# EasyEDA Pro project 蓝牙歌词音箱.epro, board 转接板PCB
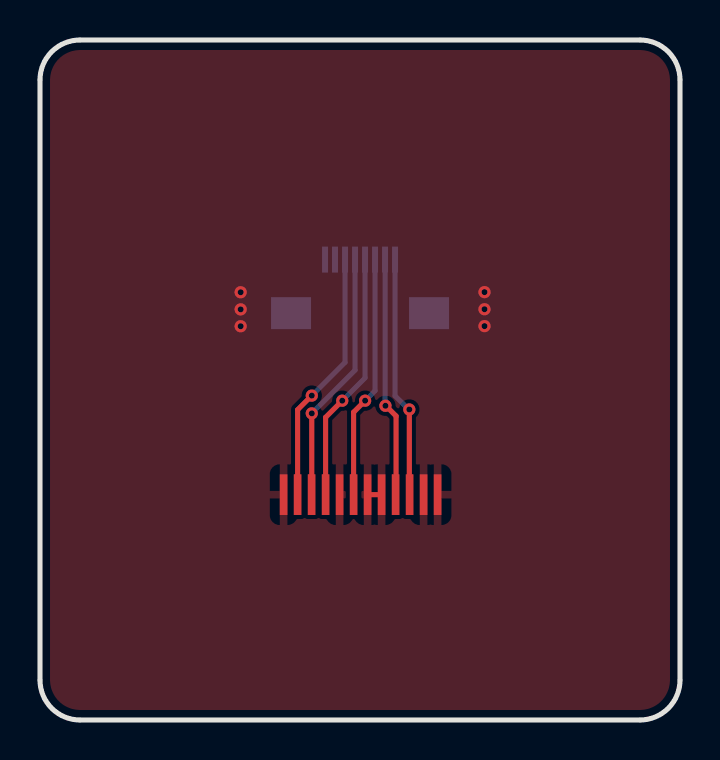
[diagram p2: board, top side]
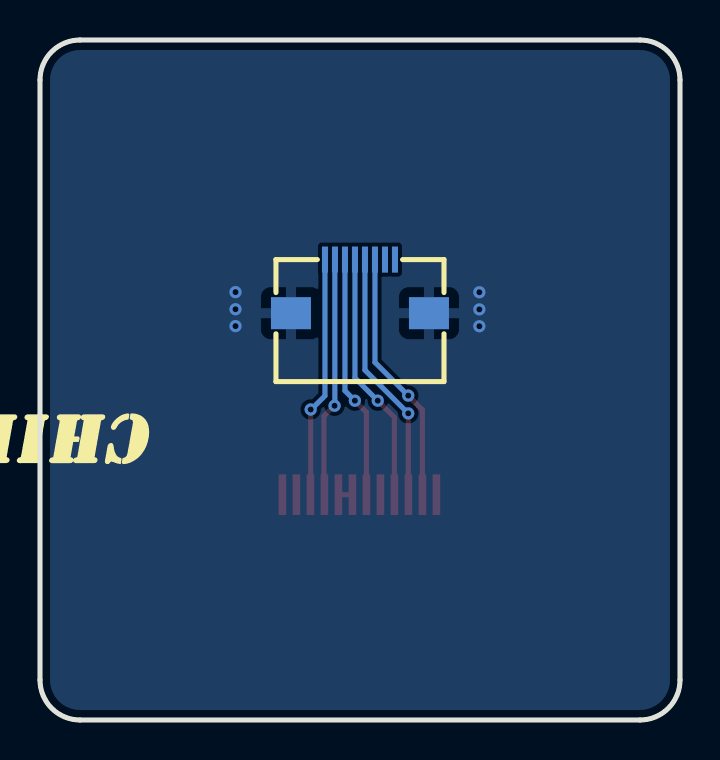
[diagram p3: board, bottom side, seen from below]

Outline 32 x 34 mm; copper layers: Top Layer, Bottom Layer. Coordinates in mm from the lower left corner of the outline.
Outline path: 0,32 0,2 arc(0.59,0.59) 2,0 30,0 arc(31.41,0.59) 32,2 32,32 arc(31.41,33.41) 30,34 2,34 arc(0.59,33.41) 0,32
Stack: Top Layer 0.035mm / Dielectric1 1.51mm FR4 er 4.5 / Bottom Layer 0.035mm

## Design rules (mm)
template: JLCPCB Capability(Two Layers Board)
spacing copperThickness1oz (default): track to track 0.102, other pairs 0.152 to 0.3
spacing copperThickness2oz: track to track 0.203, other pairs 0.152 to 0.3
track width copperThickness1oz (default): min 0.127, default 0.254, max 2.54
track width copperThickness2oz: min 0.203, default 0.254, max 2.54
differential pair differentialPair (default): width min 0.127, default 0.254, max 2.54; gap min 0.152, default 0.152
via viaSize (default): diameter min 0.5, default 0.61, max 10; hole min 0.3, default 0.305, max 6.3

## Placement (name value [footprint] x y rotation side)
FPC1  AFC01-S08FCA-00  [FPC-SMD_P0.50-8P_FGS-XJ-H2.0]  16 21.68 0 bottom
LCD1  ST7789-240x240  [LCD-240X240-12P-1.54]  16 11.52 0 top

## Footprints (pads in the part's own frame, mm; a bottom-side part is the same pattern mirrored in y, then rotated)
FPC-SMD_P0.50-8P_FGS-XJ-H2.0
  rect 0.3x1.3 smd: 1(-1.75,-1.34) 2(-1.252,-1.339) 3(-0.75,-1.34) 4(-0.25,-1.34) 5(0.25,-1.34) 6(0.75,-1.34) 7(1.25,-1.34) 8(1.75,-1.34)
  rect 2x1.6 smd: 9(3.45,1.34) 10(-3.45,1.34)
LCD-240X240-12P-1.54
  rect 0.38x2.032 smd: 1(3.878,-0.254) 2(3.178,-0.254) 3(2.478,-0.254) 4(1.778,-0.254) 5(1.078,-0.254) 6(0.378,-0.254) 7(-0.322,-0.254) 8(-1.022,-0.254) 9(-1.722,-0.254) 10(-2.422,-0.254) 11(-3.122,-0.254) 12(-3.822,-0.254)

## Nets
As in the schematic.

Pads without a net: FPC1 1 2

## Via types
v1: diameter 0.61, hole 0.305, Top Layer to Bottom Layer, 12 vias

## Routing (per net, layer and track width the routed paths; a pad name or vN(x,y) marks a point on that pad's centre or on a via; arc(x,y) is an arc through that point)
3V3: length 12
  Top Layer w0.254: 17.26,15.74 17.8,15.2 17.8,11.34 17.75,11.29
  Bottom Layer w0.254: 17.26,22.99 17.26,15.73 v1(17.27,15.71)
GND: length 0.7
  Top Layer w0.254: LCD1.6 LCD1.5
  vias: v1(10.03,21.39) v1(10.03,20.53) v1(10.03,19.69) v1(22.23,21.39) v1(22.23,20.54) v1(22.23,19.69)
IO2: length 12.7
  Top Layer w0.254: LCD1.11 12.88,15.51 v1(13.59,16.22)
  Bottom Layer w0.254: v1(13.59,16.22) 15.25,17.88 FPC1.3
IO4: length 12.2
  Top Layer w0.254: v1(16.26,15.97) 15.68,15.39 LCD1.7
  Bottom Layer w0.254: v1(16.26,15.97) 16.75,16.46 FPC1.6
IO21: length 12.7
  Top Layer w0.254: v1(13.59,15.33) 13.59,11.28 LCD1.10
  Bottom Layer w0.254: v1(13.59,15.33) 15.75,17.49 FPC1.4
IO22: length 12.6
  Top Layer w0.254: v1(15.11,15.97) 14.28,15.13 LCD1.9
  Bottom Layer w0.254: FPC1.5 16.25,17.11 v1(15.11,15.97)
LEDA: length 12.3
  Top Layer w0.254: v1(18.47,15.53) 18.47,11.05 18.44,11.03
  Bottom Layer w0.254: FPC1.8 17.75,16.21 18.47,15.49

## Copper pours and planes (outline as drawn; the poured copper is in the pictures)
GND on Top Layer: -1.27,34.76 32.89,34.76 32.89,-0.67 -1.27,-0.67
GND on Bottom Layer: -1.27,34.76 32.89,34.76 32.89,-0.67 -1.27,-0.67
